# EAGLE design MCP1640 (EAGLE 7.6.0)
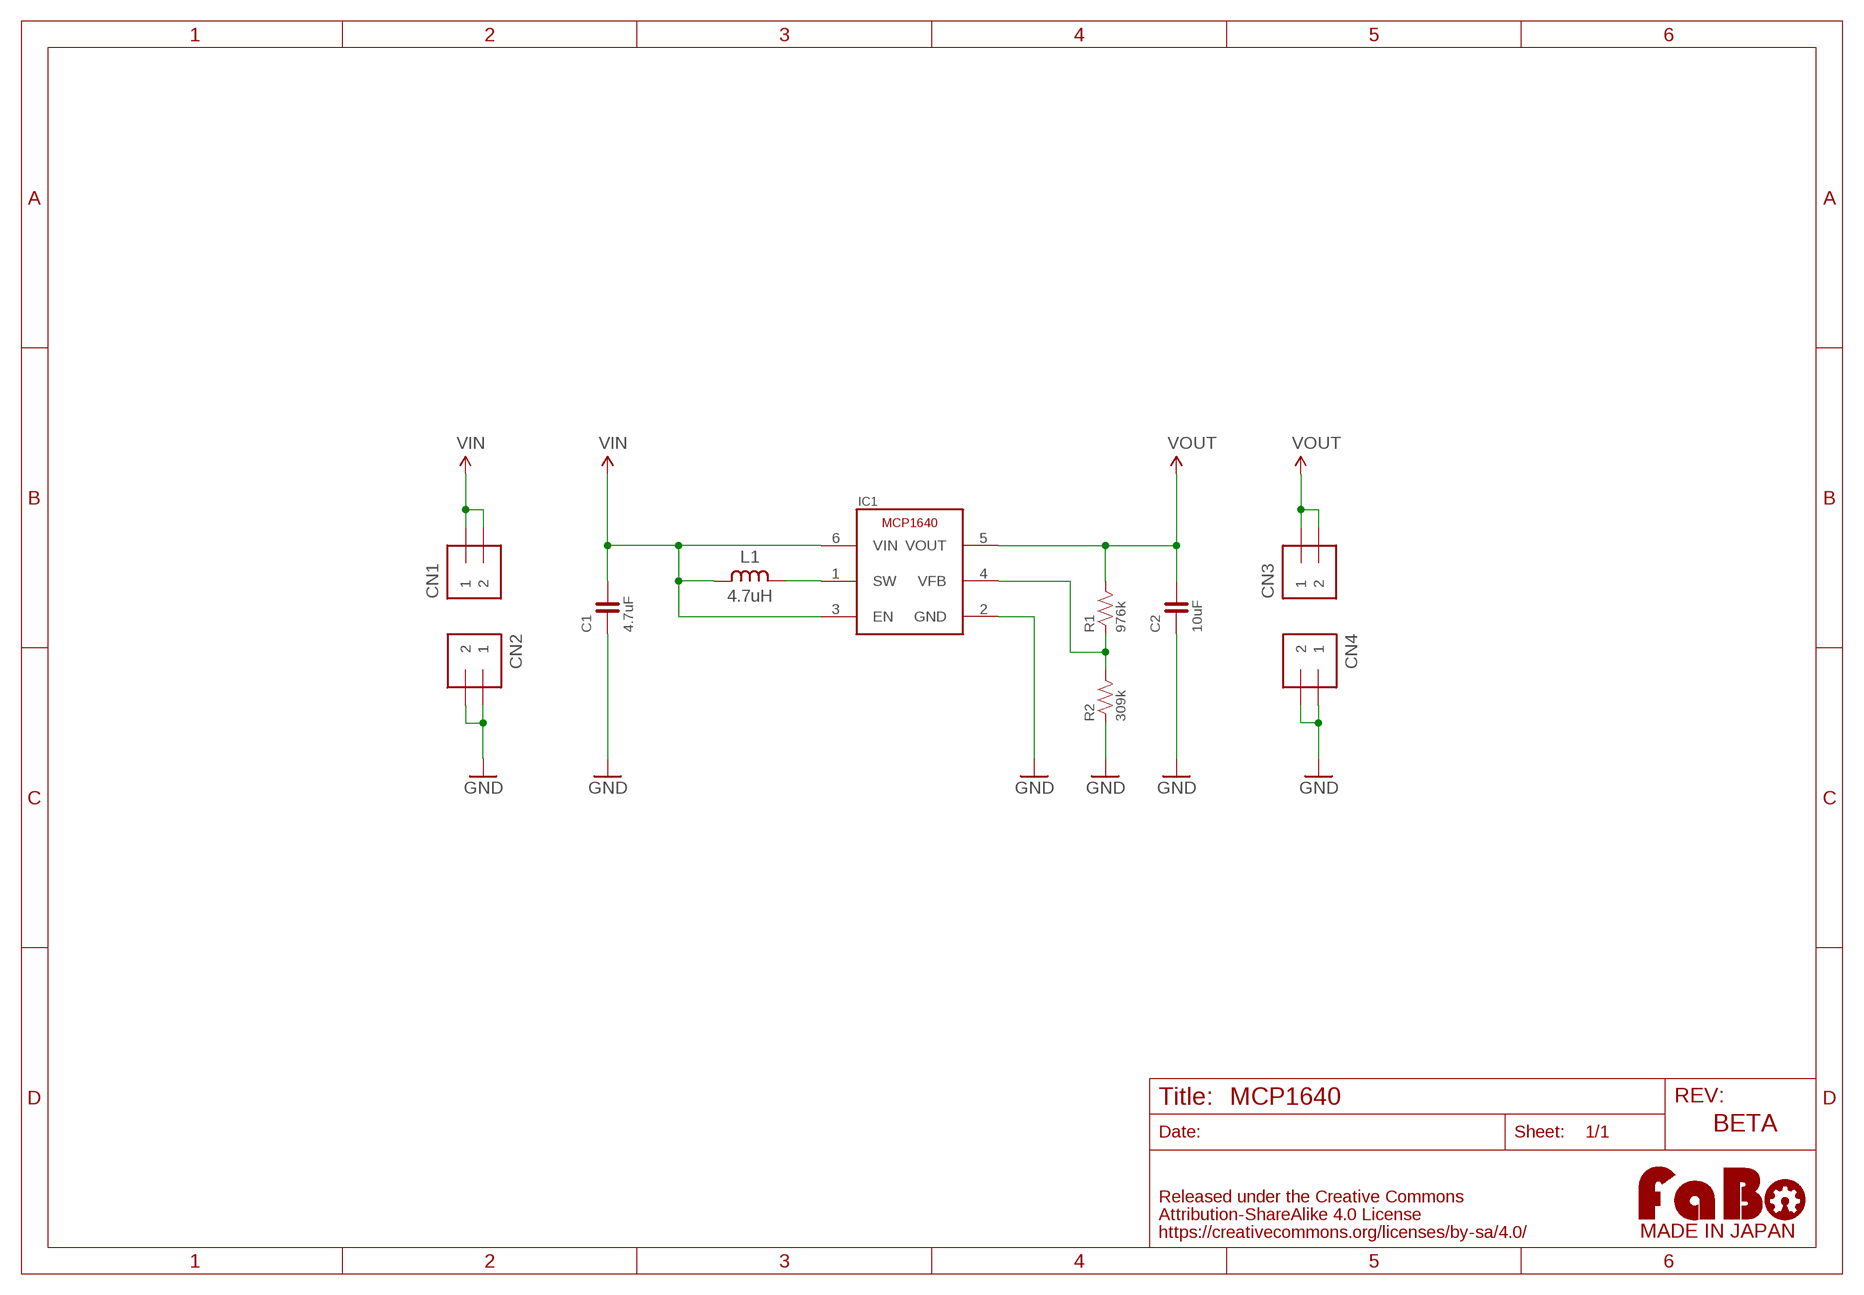
[diagram p0: schematic, sheet 1]

## Parts
C1  4.7uF  CAPACITOR-0603_NARROW  [0603-NARROW]
C2  10uF  CAPACITOR-0603_NARROW  [0603-NARROW]
CN1  PIN_HEADER_1X2  [PIN_1X2]
CN2  PIN_HEADER_1X2  [PIN_1X2]
CN3  PIN_HEADER_1X2  [PIN_1X2]
CN4  PIN_HEADER_1X2  [PIN_1X2]
IC1  MCP1640T  [SOT-23-6]
L1  4.7uH  INDUCTOR-LQH3NPN  [LQH3NPN]
R1  976k  RESISTOR-0603-NARROW  [0603-NARROW]
R2  309k  RESISTOR-0603-NARROW  [0603-NARROW]
U$2  LOGO_FABO-M_BOTTOM  [LOGO_FABO_MS_BOTTOM]

## Nets
GND: C1.1 C2.1 CN2.1 CN2.2 CN4.1 CN4.2 IC1.2(GND) R2.1
N$1: IC1.1(SW) L1.2
N$2: IC1.4(VFB) R1.1 R2.2
VIN: C1.2 CN1.1 CN1.2 IC1.3(EN) IC1.6(VIN) L1.1
VOUT: C2.2 CN3.1 CN3.2 IC1.5(VOUT) R1.2

## Notes on the sheet
- BETA

## Library data of the parts
C1 C2 = FaBo-Capacitor:CAPACITOR: CAPACITOR
CN1-CN4 = FaBo-PIN:PIN_HEADER_1X2
IC1 = FaBo-Supply:MCP1640
L1 = FaBo-Parts:INDUCTOR
R1 R2 = FaBo-Resistors:RESISTOR: RESISTOR
U$2 = FaBo-Logo:LOGO_FABO

## Board
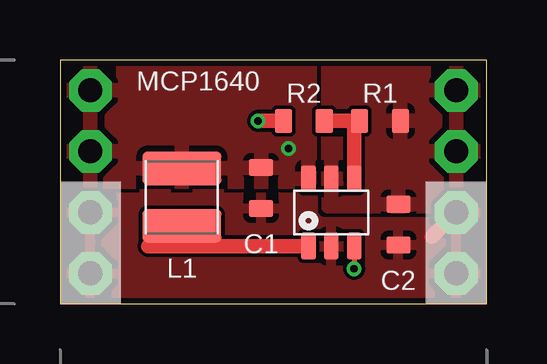
[diagram p1: board, top side]
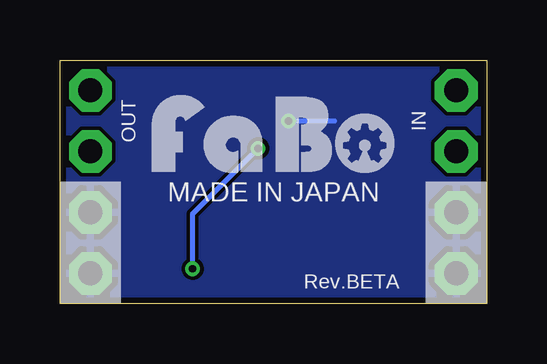
[diagram p2: board, bottom side, seen from below]

Size 17.78 x 10.16 mm. Coordinates in mm from the lower left corner, seen from the top.
Outline: 0,0 17.78,0 17.78,10.16 0,10.16 0,0
Copper layers (1*16): Top 0.035mm / dielectric 1.5mm / Bottom 0.035mm
Design rules "Elecrow_angle": minimum track width 6mil, minimum drill 12mil, track to track 6mil, track to pad 6mil, pad to pad 6mil, via to via 6mil, smd to smd 0mil, copper to edge 10mil, drill to drill 10mil, minimum pad ring 10mil, minimum via ring 6mil, stop-mask expansion 2mil, vias tented up to drill 100mil, thermal gap 10mil

### Footprints (pad centres in the part's own frame; a part is rotated, then mirrored left to right if it is on the bottom)
0603-NARROW = smd 0.71 x 1: 1 -0.85,0; 2 0.85,0
PIN_1X2 = drill 1 pad 1.778 octagon: 1 -1.27,0; 2 1.27,0
SOT-23-6 = smd 0.6 x 1.1: 1 -0.95,-1.4; 2 0,-1.4; 3 0.95,-1.4; 4 0.95,1.4; 5 0,1.4; 6 -0.95,1.4
LQH3NPN = smd 1.4 x 3.3: 1 -1.2,0; 2 1.2,0

### Placement (x,y rotation side)
C1  8.38,4.83 90 top
C2  14.1,3.3 90 top
CN1  1.27,7.62 90 top
CN2  1.27,2.54 90 top
CN3  16.51,7.62 270 top
CN4  16.51,2.54 270 top
IC1  11.3,3.81 0 top
L1  5.08,4.45 270 top
R1  13.34,7.62 0 top
R2  10.16,7.62 0 top
U$2  8.89,5.08 0 top

### Tracks (layer width: path | path; a pad name or v marks a point on that pad's centre or on a via)
GND  (via drill 0.3)
  Top 0.61: R2.1 v8.26,7.62 | CN4.1 15.49,2.79
  Bottom 0.203: v8.26,7.62 6.35,7.62
  pour Bottom: 0,10.16 17.78,10.16 17.78,0 0,0
  pour Top (rank 3): 0,4.83 17.78,4.83 17.78,0 0,0
N$1
  Top 0.203: 3.68,2.41 5.08,2.41 L1.2
  Top 0.61: IC1.1 3.68,2.41
N$2
  Top 0.203: 12.25,7.39 R1.1
  Top 0.61: IC1.4 12.25,7.39 | R1.1 R2.2
VIN  (via drill 0.3)
  Top 0.203: IC1.3 v12.25,1.46
  Bottom 0.203: v12.25,1.46 12.25,3.75 v9.53,6.48
  pour Top (rank 2): 0,10.16 10.41,10.16 10.41,5.08 0,5.08
VOUT
  pour Top: 17.78,10.16 11.18,10.16 11.18,4.06 17.78,4.06

### Text on the board
tPlace: MCP1640
bPlace: IN | OUT | MADE IN JAPAN | Rev.BETA